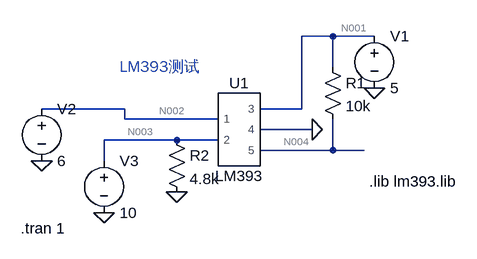
[diagram p0: schematic comparator.asc]
comparator.asc, the LTspice schematic file:
Version 4.1
SHEET 1 880 680
WIRE 320 0 272 0
WIRE 384 0 320 0
WIRE 320 48 320 0
WIRE 0 112 -128 112
WIRE 272 112 272 0
WIRE 272 112 208 112
WIRE 0 128 0 112
WIRE 144 128 0 128
WIRE 288 144 208 144
WIRE 80 160 -32 160
WIRE 144 160 80 160
WIRE 320 176 320 128
WIRE 320 176 208 176
WIRE 368 176 320 176
WIRE -32 192 -32 160
FLAG 384 80 0
FLAG 288 144 0
FLAG -32 272 0
FLAG -128 192 0
FLAG 80 240 0
SYMBOL voltage 384 -16 R0
WINDOW 123 0 0 Left 0
WINDOW 39 0 0 Left 0
SYMATTR InstName V1
SYMATTR Value 5
SYMBOL voltage -128 96 R0
WINDOW 123 0 0 Left 0
WINDOW 39 0 0 Left 0
SYMATTR InstName V2
SYMATTR Value 6
SYMBOL voltage -32 176 R0
WINDOW 123 0 0 Left 0
WINDOW 39 0 0 Left 0
SYMATTR InstName V3
SYMATTR Value 10
SYMBOL res 304 32 R0
SYMATTR InstName R1
SYMATTR Value 10k
SYMBOL LM393 176 144 R0
SYMATTR InstName U1
SYMBOL res 64 144 R0
SYMATTR InstName R2
SYMATTR Value 4.8k
TEXT -160 296 Left 2 !.tran 1
TEXT 376 224 Left 2 !.lib lm393.lib
TEXT -8 48 Left 2 ;LM393测试

The netlist it stands for:
* comparator.asc
V1 N001 0 5
V2 N002 0 6
V3 N003 0 10
R1 N001 N004 10k
X§U1 N002 N003 N001 0 N004 LM393  ; pins 1 2 3 4 5
R2 N003 0 4.8k
.tran 1
.lib lm393.lib
* LM393测试
.lib LM393.sub
.backanno
.end

* Results of the author's LTspice run, read from the files saved beside the schematic
* Operating Point, zero values left out:
*   V(n001) = 5 V
*   V(n002) = 6 V
*   V(n003) = 10 V
*   V(n004) = 50.16 mV
*   I(R1) = 495 µA
*   I(R2) = 2.083 mA
*   I(V1) = -603 µA
*   I(V2) = 49.97 nA
*   I(V3) = -2.083 mA
*   Ix(u1:1) = -49.97 nA
*   Ix(u1:2) = 13.84 pA
*   Ix(u1:3) = 108 µA
*   Ix(u1:4) = -603 µA
*   Ix(u1:5) = 495 µA